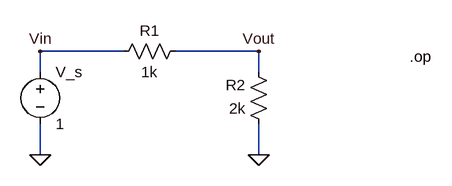
[diagram p0: schematic basic_voltage_divider.asc]
basic_voltage_divider.asc, the LTspice schematic file:
Version 4
SHEET 1 880 680
WIRE 240 208 112 208
WIRE 448 208 320 208
WIRE 112 240 112 208
WIRE 448 240 448 208
WIRE 112 368 112 320
WIRE 448 368 448 320
FLAG 112 368 0
FLAG 448 208 Vout
FLAG 448 368 0
FLAG 112 208 Vin
SYMBOL voltage 112 224 R0
SYMATTR InstName V_s
SYMATTR Value 1
SYMATTR Value2 AC 1
SYMBOL res 336 192 R90
WINDOW 0 0 56 VBottom 2
WINDOW 3 32 56 VTop 2
SYMATTR InstName R1
SYMATTR Value 1k
SYMBOL res 464 336 R180
WINDOW 0 36 76 Left 2
WINDOW 3 36 40 Left 2
SYMATTR InstName R2
SYMATTR Value 2k
TEXT 680 216 Left 2 !.op

The netlist it stands for:
* basic_voltage_divider.asc
V_s Vin 0 1 AC 1
R1 Vout Vin 1k
R2 0 Vout 2k
.op
.backanno
.end